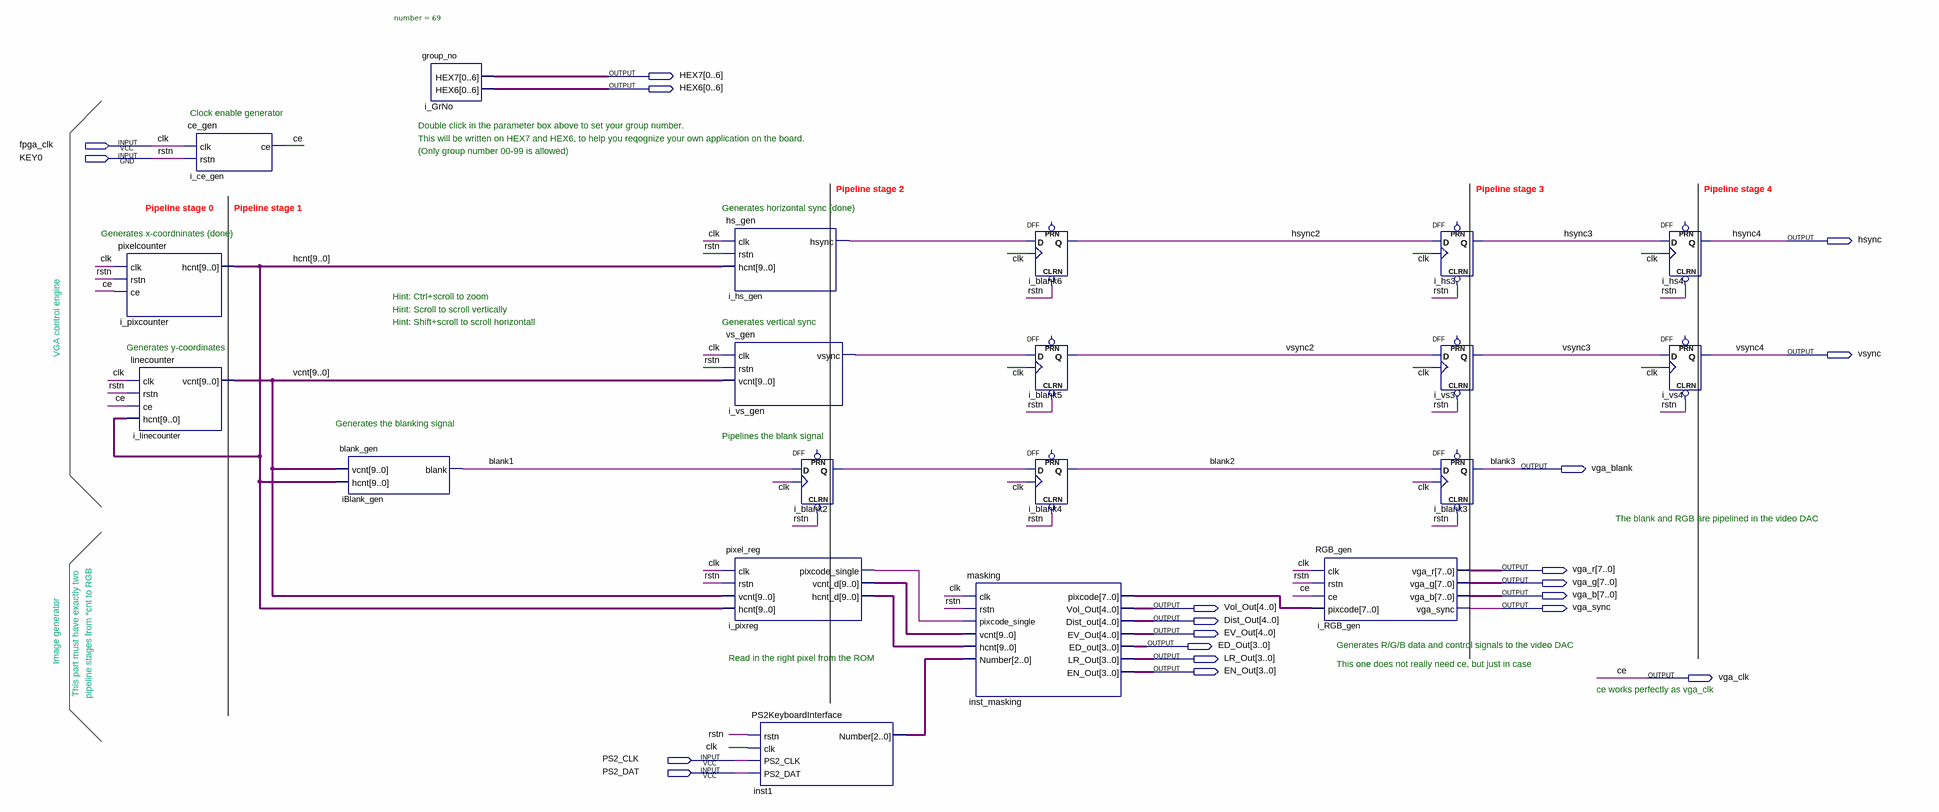
[diagram p0: schematic sheet]
// Quartus schematic VGA_contr.bdf as structural Verilog: 20 symbols, 20 pins
module VGA_contr (
  input  fpga_clk,
  input  KEY0,
  input  PS2_CLK,
  input  PS2_DAT,
  output [0:6] HEX7,
  output [0:6] HEX6,
  output hsync,
  output vsync,
  output vga_blank,
  output [7:0] vga_r,
  output [7:0] vga_g,
  output [7:0] vga_b,
  output [4:0] Vol_Out,
  output vga_sync,
  output [4:0] Dist_Out,
  output [4:0] EV_Out,
  output [3:0] ED_Out,
  output [3:0] LR_Out,
  output [3:0] EN_Out,
  output vga_clk
);

  wire blank1, blank2, hsync2, hsync3, i_blank2_q, i_hs_gen_hsync, i_pixreg_pixcode_single, i_vs_gen_vsync,
       vsync2, vsync3;
  wire [2:0] inst1_number;
  wire [7:0] inst_masking_pixcode;
  wire [9:0] hcnt, i_pixreg_hcnt_d, i_pixreg_vcnt_d, vcnt;

  pixelcounter i_pixcounter (.clk(fpga_clk), .rstn(KEY0), .ce(vga_clk), .hcnt(hcnt));
  linecounter i_linecounter (.clk(fpga_clk), .rstn(KEY0), .ce(vga_clk), .hcnt(hcnt), .vcnt(vcnt));
  ce_gen i_ce_gen (.clk(fpga_clk), .rstn(KEY0), .ce(vga_clk));
  blank_gen iBlank_gen (.vcnt(vcnt), .hcnt(hcnt), .blank(blank1));
  group_no #(.number(69)) i_GrNo (.HEX7(HEX7), .HEX6(HEX6));
  hs_gen i_hs_gen (.clk(fpga_clk), .rstn(KEY0), .hcnt(hcnt), .hsync(i_hs_gen_hsync));
  vs_gen i_vs_gen (.clk(fpga_clk), .rstn(KEY0), .vcnt(vcnt), .vsync(i_vs_gen_vsync));
  pixel_reg i_pixreg (
    .clk(fpga_clk), .rstn(KEY0), .vcnt(vcnt), .hcnt(hcnt), .pixcode_single(i_pixreg_pixcode_single),
    .vcnt_d(i_pixreg_vcnt_d), .hcnt_d(i_pixreg_hcnt_d));
  PS2KeyboardInterface inst1 (.rstn(KEY0), .clk(fpga_clk), .PS2_CLK(PS2_CLK), .PS2_DAT(PS2_DAT), .Number(inst1_number));
  DFF i_blank2 (.CLRN(KEY0), .CLK(fpga_clk), .D(blank1), .Q(i_blank2_q));  // open: PRN
  masking inst_masking (
    .clk(fpga_clk), .rstn(KEY0), .pixcode_single(i_pixreg_pixcode_single), .vcnt(i_pixreg_vcnt_d),
    .hcnt(i_pixreg_hcnt_d), .Number(inst1_number), .pixcode(inst_masking_pixcode), .Vol_Out(Vol_Out),
    .Dist_out(Dist_Out), .EV_Out(EV_Out), .ED_out(ED_Out), .LR_Out(LR_Out), .EN_Out(EN_Out));
  DFF i_blank6 (.CLRN(KEY0), .CLK(fpga_clk), .D(i_hs_gen_hsync), .Q(hsync2));  // open: PRN
  DFF i_blank5 (.CLRN(KEY0), .CLK(fpga_clk), .D(i_vs_gen_vsync), .Q(vsync2));  // open: PRN
  DFF i_blank4 (.CLRN(KEY0), .CLK(fpga_clk), .D(i_blank2_q), .Q(blank2));  // open: PRN
  RGB_gen i_RGB_gen (
    .clk(fpga_clk), .rstn(KEY0), .ce(vga_clk), .pixcode(inst_masking_pixcode), .vga_r(vga_r), .vga_g(vga_g),
    .vga_b(vga_b), .vga_sync(vga_sync));
  DFF i_hs3 (.CLRN(KEY0), .CLK(fpga_clk), .D(hsync2), .Q(hsync3));  // open: PRN
  DFF i_vs3 (.CLRN(KEY0), .CLK(fpga_clk), .D(vsync2), .Q(vsync3));  // open: PRN
  DFF i_blank3 (.CLRN(KEY0), .CLK(fpga_clk), .D(blank2), .Q(vga_blank));  // open: PRN
  DFF i_hs4 (.CLRN(KEY0), .CLK(fpga_clk), .D(hsync3), .Q(hsync));  // open: PRN
  DFF i_vs4 (.CLRN(KEY0), .CLK(fpga_clk), .D(vsync3), .Q(vsync));  // open: PRN

  // Other names for the same wires on the sheet: blank3 = vga_blank; ce = vga_clk; clk = fpga_clk; hsync4 = hsync;
  //   rstn = KEY0; vsync4 = vsync

  // Notes on the sheet:
  //   Clock enable generator
  //   Double click in the parameter box above to set your group number.
  //   This will be written on HEX7 and HEX6, to help you reqognize your own application on the board.
  //   (Only group number 00-99 is allowed)
  //   Pipeline stage 2
  //   Pipeline stage 3
  //   Pipeline stage 4
  //   Pipeline stage 0
  //   Pipeline stage 1
  //   Generates horizontal sync (done)
  //   Generates x-coordninates (done)
  //   VGA control engine
  //   Hint: Ctrl+scroll to zoom
  //   Hint: Scroll to scroll vertically
  //   Hint: Shift+scroll to scroll horizontall
  //   Generates vertical sync
  //   Generates y-coordinates
  //   Generates the blanking signal
  //   Pipelines the blank signal
  //   The blank and RGB are pipelined in the video DAC
  //   This part must have exactly two
  //   pipeline stages from *cnt to RGB
  //   Image generator
  //   Generates R/G/B data and control signals to the video DAC
  //   Read in the right pixel from the ROM
  //   This one does not really need ce, but just in case
  //   ce works perfectly as vga_clk
endmodule
